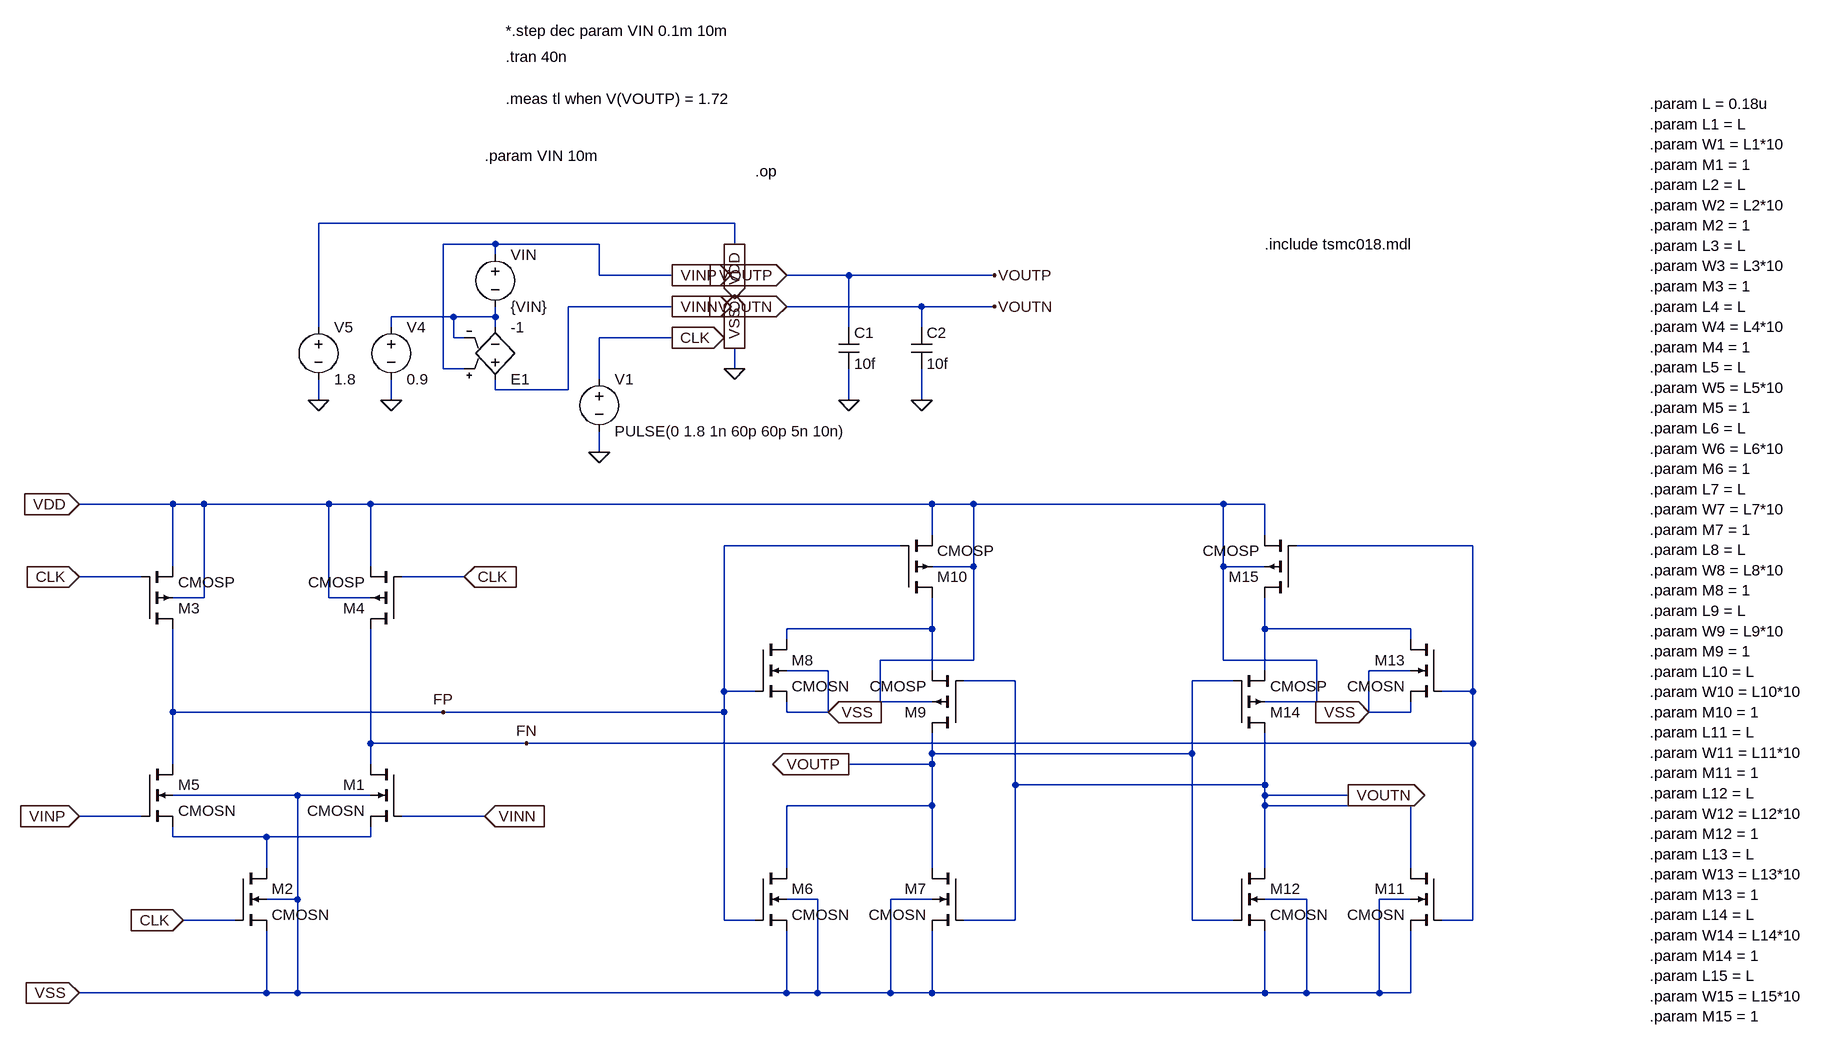
[diagram p0: schematic tb_my_comparator.asc]
tb_my_comparator.asc, the LTspice schematic file:
Version 4
SHEET 1 1836 1316
WIRE 240 80 -400 80
WIRE -128 112 -208 112
WIRE 32 112 -128 112
WIRE 240 112 240 80
WIRE -128 128 -128 112
WIRE 32 160 32 112
WIRE 144 160 32 160
WIRE 416 160 320 160
WIRE 640 160 416 160
WIRE 144 208 -16 208
WIRE 528 208 320 208
WIRE 640 208 528 208
WIRE -192 224 -288 224
WIRE -128 224 -128 208
WIRE -128 224 -192 224
WIRE -400 240 -400 80
WIRE -288 240 -288 224
WIRE -128 240 -128 224
WIRE 416 240 416 160
WIRE 528 240 528 208
WIRE -192 256 -192 224
WIRE -176 256 -192 256
WIRE 144 256 32 256
WIRE -208 304 -208 112
WIRE -176 304 -208 304
WIRE 240 304 240 272
WIRE 32 320 32 256
WIRE -128 336 -128 320
WIRE -16 336 -16 208
WIRE -16 336 -128 336
WIRE -400 352 -400 320
WIRE -288 352 -288 320
WIRE 416 352 416 304
WIRE 528 352 528 304
WIRE 32 432 32 400
WIRE -624 512 -768 512
WIRE -576 512 -624 512
WIRE -384 512 -576 512
WIRE -320 512 -384 512
WIRE 544 512 -320 512
WIRE 608 512 544 512
WIRE 992 512 608 512
WIRE 1056 512 992 512
WIRE 544 560 544 512
WIRE 1056 560 1056 512
WIRE 496 576 224 576
WIRE 1376 576 1104 576
WIRE -624 608 -624 512
WIRE -320 608 -320 512
WIRE 608 608 608 512
WIRE 608 608 544 608
WIRE 992 608 992 512
WIRE 1056 608 992 608
WIRE -672 624 -768 624
WIRE -176 624 -272 624
WIRE -576 656 -576 512
WIRE -576 656 -624 656
WIRE -384 656 -384 512
WIRE -320 656 -384 656
WIRE 544 704 544 656
WIRE 544 704 320 704
WIRE 1056 704 1056 656
WIRE 1280 704 1056 704
WIRE 320 720 320 704
WIRE 1280 720 1280 704
WIRE 608 752 608 608
WIRE 608 752 464 752
WIRE 992 752 992 608
WIRE 1136 752 992 752
WIRE 384 768 320 768
WIRE 544 768 544 704
WIRE 1056 768 1056 704
WIRE 1280 768 1216 768
WIRE 672 784 592 784
WIRE 1008 784 944 784
WIRE 224 800 224 576
WIRE 272 800 224 800
WIRE 1376 800 1376 576
WIRE 1376 800 1328 800
WIRE 464 816 464 752
WIRE 544 816 464 816
WIRE 1136 816 1136 752
WIRE 1136 816 1056 816
WIRE -624 832 -624 704
WIRE -208 832 -624 832
WIRE 224 832 224 800
WIRE 224 832 -208 832
WIRE 320 832 320 816
WIRE 384 832 384 768
WIRE 384 832 320 832
WIRE 1216 832 1216 768
WIRE 1280 832 1280 816
WIRE 1280 832 1216 832
WIRE -320 880 -320 704
WIRE -80 880 -320 880
WIRE 1376 880 1376 800
WIRE 1376 880 -80 880
WIRE 544 896 544 864
WIRE 944 896 944 784
WIRE 944 896 544 896
WIRE -624 912 -624 832
WIRE -320 912 -320 880
WIRE 544 912 544 896
WIRE 544 912 416 912
WIRE 672 944 672 784
WIRE 1056 944 1056 864
WIRE 1056 944 672 944
WIRE -432 960 -624 960
WIRE -320 960 -432 960
WIRE 1056 960 1056 944
WIRE 1184 960 1056 960
WIRE 544 976 544 912
WIRE 544 976 320 976
WIRE 1056 976 1056 960
WIRE 1280 976 1056 976
WIRE -672 992 -768 992
WIRE -144 992 -272 992
WIRE -624 1024 -624 1008
WIRE -480 1024 -624 1024
WIRE -320 1024 -320 1008
WIRE -320 1024 -480 1024
WIRE -480 1072 -480 1024
WIRE 320 1072 320 976
WIRE 544 1072 544 976
WIRE 1056 1072 1056 976
WIRE 1280 1072 1280 976
WIRE -432 1120 -432 960
WIRE -432 1120 -480 1120
WIRE 368 1120 320 1120
WIRE 544 1120 480 1120
WIRE 1120 1120 1056 1120
WIRE 1280 1120 1232 1120
WIRE -528 1152 -608 1152
WIRE 224 1152 224 832
WIRE 272 1152 224 1152
WIRE 672 1152 672 944
WIRE 672 1152 592 1152
WIRE 944 1152 944 896
WIRE 1008 1152 944 1152
WIRE 1376 1152 1376 880
WIRE 1376 1152 1328 1152
WIRE -480 1264 -480 1168
WIRE -480 1264 -768 1264
WIRE -432 1264 -432 1120
WIRE -432 1264 -480 1264
WIRE 320 1264 320 1168
WIRE 320 1264 -432 1264
WIRE 368 1264 368 1120
WIRE 368 1264 320 1264
WIRE 480 1264 480 1120
WIRE 480 1264 368 1264
WIRE 544 1264 544 1168
WIRE 544 1264 480 1264
WIRE 1056 1264 1056 1168
WIRE 1056 1264 544 1264
WIRE 1120 1264 1120 1120
WIRE 1120 1264 1056 1264
WIRE 1232 1264 1232 1120
WIRE 1232 1264 1120 1264
WIRE 1280 1264 1280 1168
WIRE 1280 1264 1232 1264
FLAG -400 352 0
FLAG -288 352 0
FLAG 32 432 0
FLAG 416 352 0
FLAG 528 352 0
FLAG 240 304 0
FLAG 640 160 VOUTP
FLAG 640 208 VOUTN
FLAG -768 512 VDD
IOPIN -768 512 In
FLAG -768 624 CLK
IOPIN -768 624 In
FLAG -768 992 VINP
IOPIN -768 992 In
FLAG -768 1264 VSS
IOPIN -768 1264 In
FLAG -144 992 VINN
IOPIN -144 992 In
FLAG -608 1152 CLK
IOPIN -608 1152 In
FLAG -176 624 CLK
IOPIN -176 624 In
FLAG 384 832 VSS
IOPIN 384 832 In
FLAG 416 912 VOUTP
IOPIN 416 912 Out
FLAG 1216 832 VSS
IOPIN 1216 832 In
FLAG 1184 960 VOUTN
IOPIN 1184 960 Out
FLAG 240 112 VDD
IOPIN 240 112 Out
FLAG 240 272 VSS
IOPIN 240 272 Out
FLAG 144 256 CLK
IOPIN 144 256 Out
FLAG 144 208 VINN
IOPIN 144 208 Out
FLAG 144 160 VINP
IOPIN 144 160 Out
FLAG 320 160 VOUTP
IOPIN 320 160 In
FLAG 320 208 VOUTN
IOPIN 320 208 In
FLAG -208 832 FP
FLAG -80 880 FN
DATAFLAG 1136 960 ""
SYMBOL voltage 32 304 R0
WINDOW 123 0 0 Left 0
WINDOW 39 0 0 Left 0
SYMATTR InstName V1
SYMATTR Value PULSE(0 1.8 1n 60p 60p 5n 10n)
SYMBOL voltage -128 112 R0
WINDOW 123 0 0 Left 0
WINDOW 39 0 0 Left 0
SYMATTR InstName VIN
SYMATTR Value {VIN}
SYMBOL voltage -288 224 R0
WINDOW 123 0 0 Left 0
WINDOW 39 0 0 Left 0
SYMATTR InstName V4
SYMATTR Value 0.9
SYMBOL voltage -400 224 R0
WINDOW 123 0 0 Left 0
WINDOW 39 0 0 Left 0
SYMATTR InstName V5
SYMATTR Value 1.8
SYMBOL e -128 336 M180
SYMATTR InstName E1
SYMATTR Value -1
SYMBOL cap 400 240 R0
SYMATTR InstName C1
SYMATTR Value 10f
SYMBOL cap 512 240 R0
SYMATTR InstName C2
SYMATTR Value 10f
SYMBOL nmos4 -272 912 M0
SYMATTR InstName M1
SYMATTR Value CMOSN
SYMATTR Value2 l={L2} w={W2} m={M2}
SYMBOL nmos4 -528 1072 R0
SYMATTR InstName M2
SYMATTR Value CMOSN
SYMATTR Value2 l={L3} w={W3} m={M3}
SYMBOL pmos4 -672 704 M180
SYMATTR InstName M3
SYMATTR Value CMOSP
SYMATTR Value2 l={L4} w={W4} m={M4}
SYMBOL pmos4 -272 704 R180
SYMATTR InstName M4
SYMATTR Value CMOSP
SYMATTR Value2 l={L5} w={W5} m={M5}
SYMBOL nmos4 -672 912 R0
SYMATTR InstName M5
SYMATTR Value CMOSN
SYMATTR Value2 l={L1} w={W1} m={M1}
SYMBOL nmos4 272 1072 R0
SYMATTR InstName M6
SYMATTR Value CMOSN
SYMATTR Value2 l={L6} w={W6} m={M6}
SYMBOL nmos4 592 1072 M0
SYMATTR InstName M7
SYMATTR Value CMOSN
SYMATTR Value2 l={L7} w={W7} m={M7}
SYMBOL nmos4 272 720 R0
SYMATTR InstName M8
SYMATTR Value CMOSN
SYMATTR Value2 l={L8} w={W8} m={M8}
SYMBOL pmos4 592 864 R180
SYMATTR InstName M9
SYMATTR Value CMOSP
SYMATTR Value2 l={L9} w={W9} m={M9}
SYMBOL pmos4 496 656 M180
SYMATTR InstName M10
SYMATTR Value CMOSP
SYMATTR Value2 l={L10} w={W10} m={M10}
SYMBOL nmos4 1328 1072 M0
SYMATTR InstName M11
SYMATTR Value CMOSN
SYMATTR Value2 l={L11} w={W11} m={M11}
SYMBOL nmos4 1008 1072 R0
SYMATTR InstName M12
SYMATTR Value CMOSN
SYMATTR Value2 l={L12} w={W12} m={M12}
SYMBOL nmos4 1328 720 M0
SYMATTR InstName M13
SYMATTR Value CMOSN
SYMATTR Value2 l={L13} w={W13} m={M13}
SYMBOL pmos4 1008 864 M180
SYMATTR InstName M14
SYMATTR Value CMOSP
SYMATTR Value2 l={L14} w={W14} m={M14}
SYMBOL pmos4 1104 656 R180
SYMATTR InstName M15
SYMATTR Value CMOSP
SYMATTR Value2 l={L15} w={W15} m={M15}
TEXT -112 -216 Left 2 !*.step dec param VIN 0.1m 10m
TEXT -112 -176 Left 2 !.tran 40n
TEXT -112 -112 Left 2 !.meas tl when V(VOUTP) = 1.72
TEXT 272 0 Left 2 !.op
TEXT 1648 -104 Left 2 !.param L = 0.18u\n.param L1 = L\n.param W1 = L1*10\n.param M1 = 1\n.param L2 = L\n.param W2 = L2*10\n.param M2 = 1\n.param L3 = L\n.param W3 = L3*10\n.param M3 = 1\n.param L4 = L\n.param W4 = L4*10\n.param M4 = 1\n.param L5 = L\n.param W5 = L5*10\n.param M5 = 1\n.param L6 = L\n.param W6 = L6*10\n.param M6 = 1\n.param L7 = L\n.param W7 = L7*10\n.param M7 = 1\n.param L8 = L\n.param W8 = L8*10\n.param M8 = 1\n.param L9 = L\n.param W9 = L9*10\n.param M9 = 1\n.param L10 = L\n.param W10 = L10*10\n.param M10 = 1\n.param L11 = L\n.param W11 = L11*10\n.param M11 = 1\n.param L12 = L\n.param W12 = L12*10\n.param M12 = 1\n.param L13 = L\n.param W13 = L13*10\n.param M13 = 1\n.param L14 = L\n.param W14 = L14*10\n.param M14 = 1\n.param L15 = L\n.param W15 = L15*10\n.param M15 = 1
TEXT 1056 112 Left 2 !.include tsmc018.mdl
TEXT -144 -24 Left 2 !.param VIN 10m

The netlist it stands for:
* tb_my_comparator.asc
V1 CLK 0 PULSE(0 1.8 1n 60p 60p 5n 10n)
VIN VINP N001 {VIN}
V4 N001 0 0.9
V5 VDD 0 1.8
E1 VINN N001 VINP N001 -1
C1 VOUTP 0 10f
C2 VOUTN 0 10f
M1 FN VINN N004 0 CMOSN l={L2} w={W2} m={M2}
M2 N004 CLK 0 0 CMOSN l={L3} w={W3} m={M3}
M3 FP CLK VDD VDD CMOSP l={L4} w={W4} m={M4}
M4 FN CLK VDD VDD CMOSP l={L5} w={W5} m={M5}
M5 FP VINP N004 0 CMOSN l={L1} w={W1} m={M1}
M6 VOUTP FP 0 0 CMOSN l={L6} w={W6} m={M6}
M7 VOUTP VOUTN 0 0 CMOSN l={L7} w={W7} m={M7}
M8 N002 FP 0 0 CMOSN l={L8} w={W8} m={M8}
M9 VOUTP VOUTN N002 VDD CMOSP l={L9} w={W9} m={M9}
M10 N002 FP VDD VDD CMOSP l={L10} w={W10} m={M10}
M11 VOUTN FN 0 0 CMOSN l={L11} w={W11} m={M11}
M12 VOUTN VOUTP 0 0 CMOSN l={L12} w={W12} m={M12}
M13 N003 FN 0 0 CMOSN l={L13} w={W13} m={M13}
M14 VOUTN VOUTP N003 VDD CMOSP l={L14} w={W14} m={M14}
M15 N003 FN VDD VDD CMOSP l={L15} w={W15} m={M15}
.model NMOS NMOS
.model PMOS PMOS
.lib standard.mos
*.step dec param VIN 0.1m 10m
.tran 40n
.meas tl when V(VOUTP) = 1.72
.op
.param L = 0.18u
.param L1 = L
.param W1 = L1*10
.param M1 = 1
.param L2 = L
.param W2 = L2*10
.param M2 = 1
.param L3 = L
.param W3 = L3*10
.param M3 = 1
.param L4 = L
.param W4 = L4*10
.param M4 = 1
.param L5 = L
.param W5 = L5*10
.param M5 = 1
.param L6 = L
.param W6 = L6*10
.param M6 = 1
.param L7 = L
.param W7 = L7*10
.param M7 = 1
.param L8 = L
.param W8 = L8*10
.param M8 = 1
.param L9 = L
.param W9 = L9*10
.param M9 = 1
.param L10 = L
.param W10 = L10*10
.param M10 = 1
.param L11 = L
.param W11 = L11*10
.param M11 = 1
.param L12 = L
.param W12 = L12*10
.param M12 = 1
.param L13 = L
.param W13 = L13*10
.param M13 = 1
.param L14 = L
.param W14 = L14*10
.param M14 = 1
.param L15 = L
.param W15 = L15*10
.param M15 = 1
.include tsmc018.mdl
.param VIN 10m
.backanno
.end